# Altium schematic sheet STM32MP1-SOM-Eth.SchDoc: Ethernet PHY with RJ45 connector
size A2; Date: Not used; ApprovedBy: Not used; CheckedBy: Not used; Author: Not used; CompanyName: STMicroelectronics; DrawnBy: Not used; Engineer: Not used; Organization: Not used; Address1: Not used; Address2: Not used; Address3: Not used; Address4: Not used; DocumentNumber: 6; Revision: Not used; SheetNumber: 6; SheetTotal: 9; Time: Not used; ImagePath: Not used; Application_BuildNumber: Not used
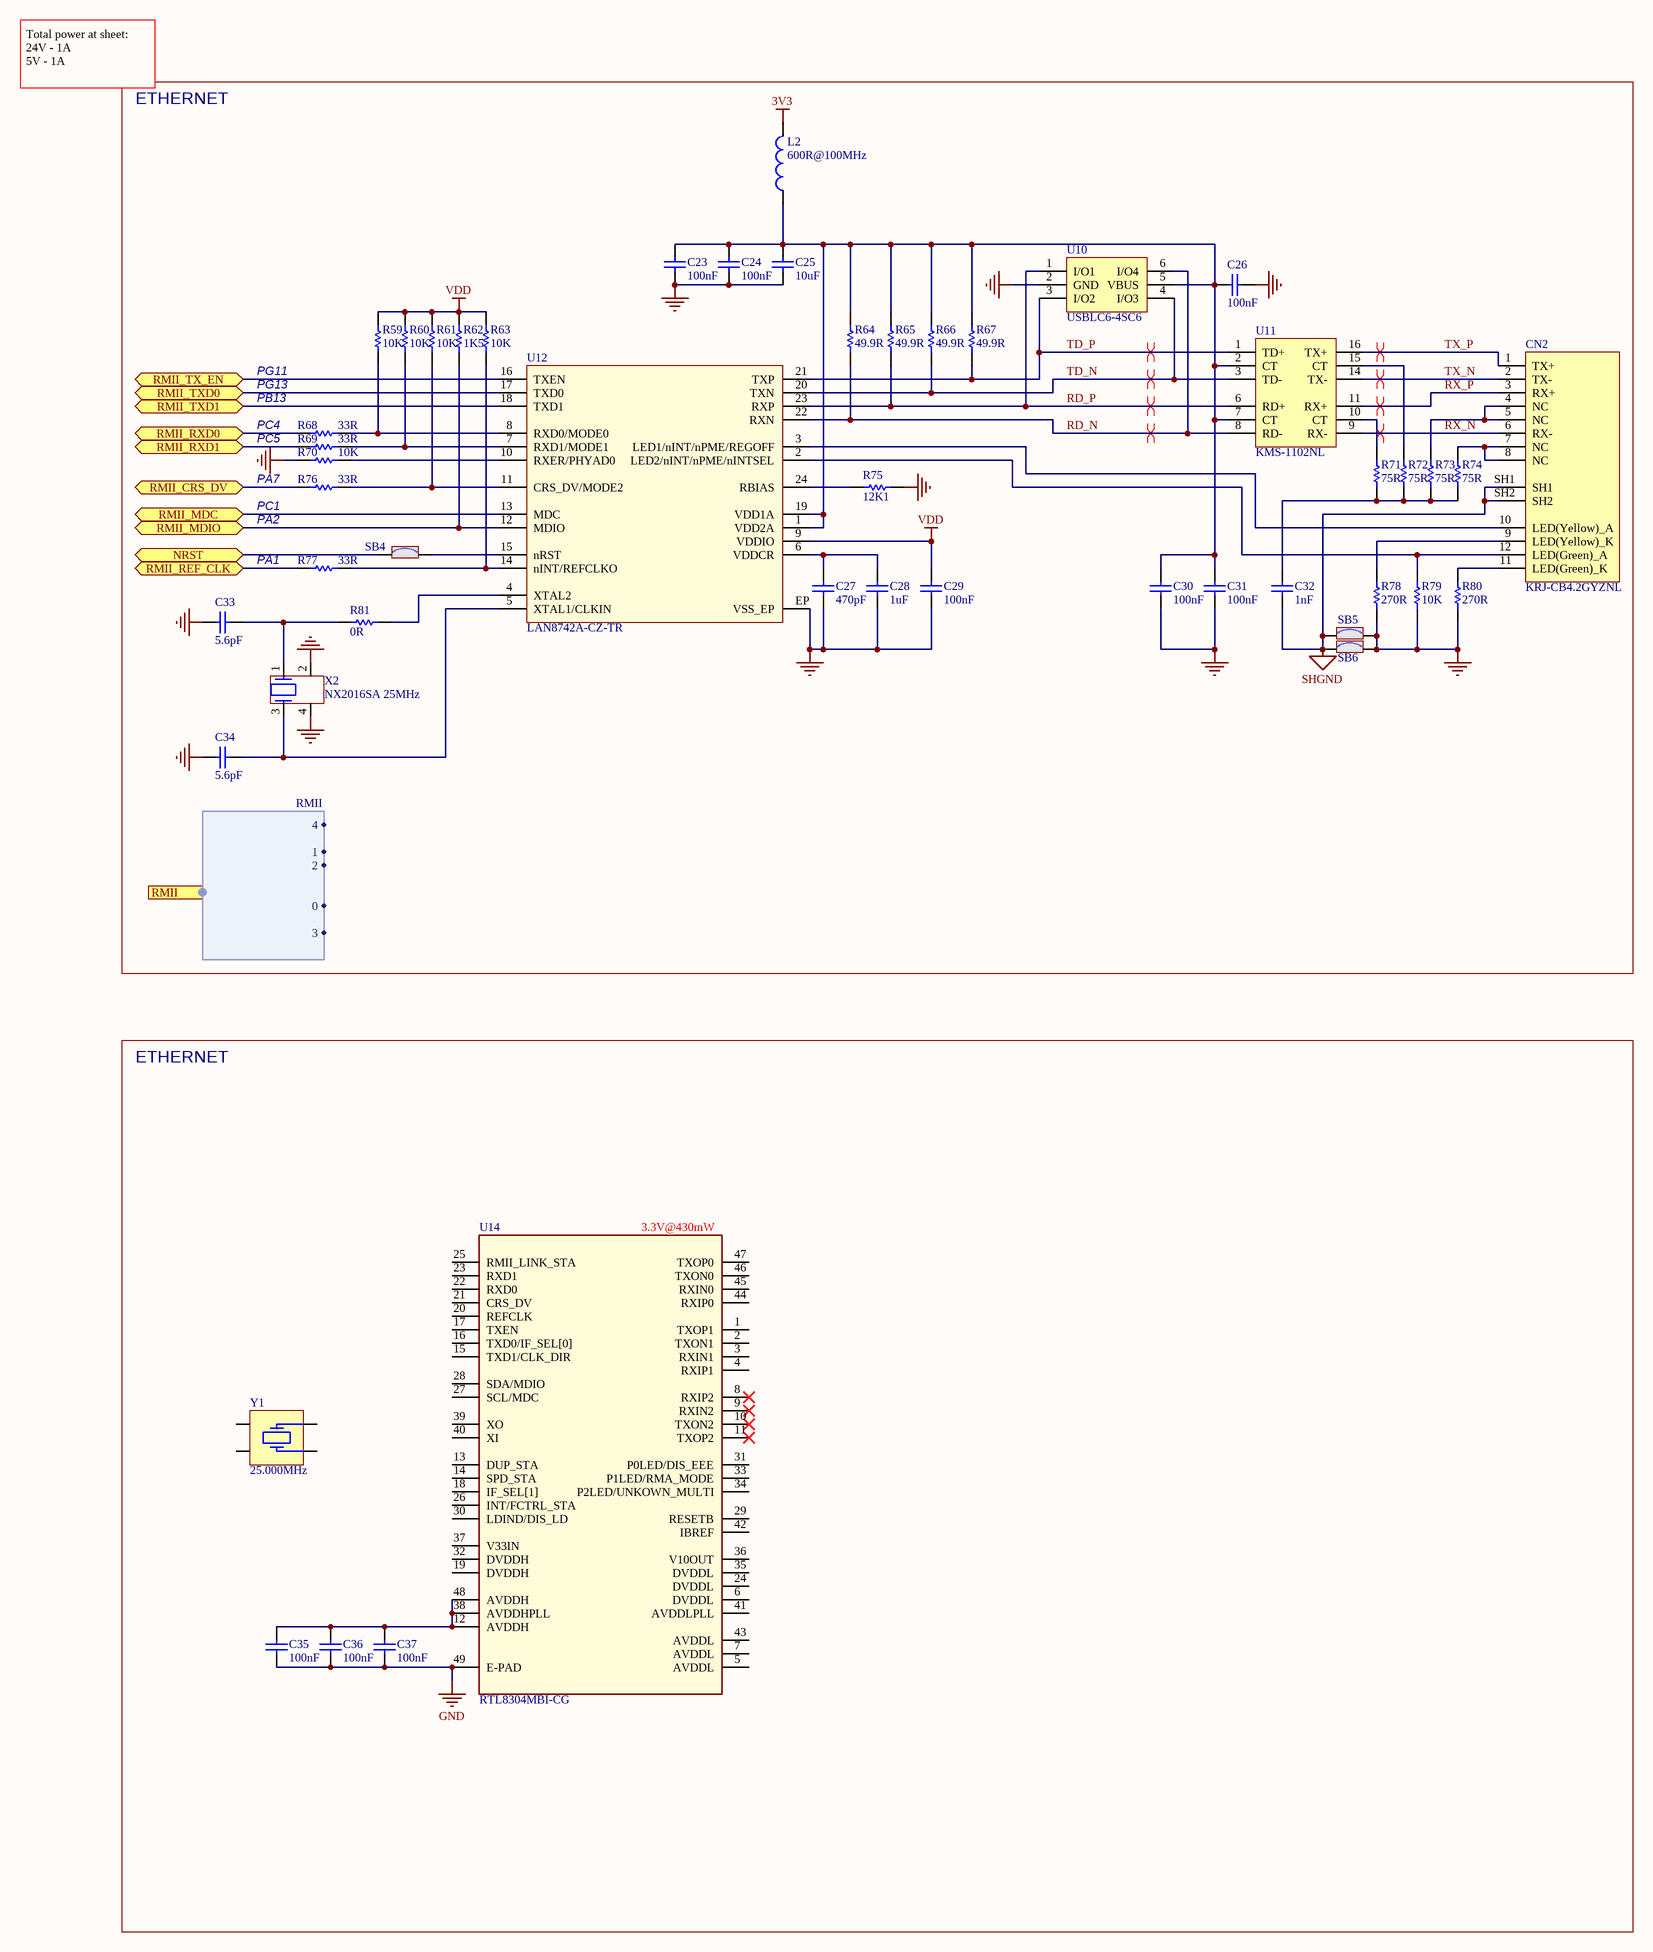
[diagram p0: STM32MP1-SOM-Eth.SchDoc]

## Parts
C23  value 100nF  [C0603]  (hidden comment: Capacitor)
C24  value 100nF  [C0603]  (hidden comment: Capacitor)
C25  value 10uF  [C0603]  (hidden comment: Capacitor)
C26  value 100nF  [C0603]  (hidden comment: Capacitor)
C27  value 470pF  [C0402]  (hidden comment: Capacitor)
C28  value 1uF  [C0402]  (hidden comment: Capacitor)
C29  value 100nF  [C0603]  (hidden comment: Capacitor)
C30  value 100nF  [C0603]  (hidden comment: Capacitor)
C31  value 100nF  [C0603]  (hidden comment: Capacitor)
C32  value 1nF  [C1206_H1P6]  (hidden comment: Capacitor)
C33  value 5.6pF  [C0402]  (hidden comment: Capacitor)
C34  value 5.6pF  [C0402]  (hidden comment: Capacitor)
C35  value 100nF  [C0603]  (hidden comment: Capacitor)
C36  value 100nF  [C0603]  (hidden comment: Capacitor)
C37  value 100nF  [C0603]  (hidden comment: Capacitor)
CN2  value KRJ-CB4.2GYZNL  [CON_RJ45_DGKYD_KRJ-CB4.2GYZNL]  (hidden comment: RJ45_KRJ-CB4.2GYZNL)
L2  value 600R@100MHz  [L0603]  (hidden comment: BEAD)
R59  value 10K  [R0402]  (hidden comment: Resistor)
R60  value 10K  [R0402]  (hidden comment: Resistor)
R61  value 10K  [R0402]  (hidden comment: Resistor)
R62  value 1K5  [R0402]  (hidden comment: Resistor)
R63  value 10K  [R0402]  (hidden comment: Resistor)
R64  value 49.9R  [R0402]  (hidden comment: Resistor)
R65  value 49.9R  [R0402]  (hidden comment: Resistor)
R66  value 49.9R  [R0402]  (hidden comment: Resistor)
R67  value 49.9R  [R0402]  (hidden comment: Resistor)
R68  value 33R  [R0402]  (hidden comment: Resistor)
R69  value 33R  [R0402]  (hidden comment: Resistor)
R70  value 10K  [R0402]  (hidden comment: Resistor)
R71  value 75R  [R0402]  (hidden comment: Resistor)
R72  value 75R  [R0402]  (hidden comment: Resistor)
R73  value 75R  [R0402]  (hidden comment: Resistor)
R74  value 75R  [R0402]  (hidden comment: Resistor)
R75  value 12K1  [R0402]  (hidden comment: Resistor)
R76  value 33R  [R0402]  (hidden comment: Resistor)
R77  value 33R  [R0402]  (hidden comment: Resistor)
R78  value 270R  [R0402]  (hidden comment: Resistor)
R79  value 10K  [R0402]  (hidden comment: Resistor)
R80  value 270R  [R0402]  (hidden comment: Resistor)
R81  value 0R  [R0402]  (hidden comment: Resistor)
SB4  SB_ON  [SOLDER-BRIDGE_R0603-0R]  (value not drawn)
SB5  SB_ON  [SOLDER-BRIDGE_R0603-0R]  (value not drawn)
SB6  SB_ON  [SOLDER-BRIDGE_R0603-0R]  (value not drawn)
U10  USBLC6-4SC6  [ESD_SOT23-6L]
U11  KMS-1102NL  [TRS_DGKYD_KMS-1102NL]
U12  LAN8742A-CZ-TR  [ICC_VQFN24-EPAD_4X4_P050]
U14  RTL8304MBI-CG  [QFN48_SMALL_EP_7MMX7MM]
X2  value NX2016SA 25MHz  [CRY_NX2016SA_4P]  (hidden comment: XTAL_4_PINS)
Y1  25.000MHz  [ABM8G]

## Blocks framed on the sheet
ETHERNET: C23-C34 CN2 L2 R59-R81 SB4-SB6 U10-U12 X2
ETHERNET: C35-C37 U14 Y1

## Ports
NRST (bidir), RMII (harness RMII), RMII_CRS_DV (bidir), RMII_MDC (bidir), RMII_MDIO (bidir), RMII_REF_CLK (bidir), RMII_RXD0 (bidir), RMII_RXD1 (bidir), RMII_TX_EN (bidir), RMII_TXD0 (bidir), RMII_TXD1 (bidir)

## Harnesses
RMII: 0, 1, 2, 3, 4

## Nets
3V3: L2.2
GND: C23.1 C24.1 C25.1 C26.2 C27.1 C28.1 C29.1 C30.1 C31.1 C33.1 C34.1 C35.1 C36.1 C37.1 R70.2 R75.2 R78.1 R79.1 R80.1 SB5.2 SB6.2 U10.2(GND) U12.EP(VSS_EP) U14.49(E-PAD) X2.2 X2.4
SHGND: C32.1 CN2.SH1 CN2.SH2 SB5.1 SB6.1
VDD: C29.2 R59.2 R60.2 R61.2 R62.2 R63.2 U12.9(VDDIO)
NRST: SB4.1 ; port NRST
RD_N: R64.1 U10.6(I/O4) U11.8(RD-) U12.22(RXN)
RD_P: R65.1 U10.1(I/O1) U11.6(RD+) U12.23(RXP)
RMII_CRS_DV: R76.1 ; port RMII_CRS_DV
RMII_MDC: U12.13(MDC) ; port RMII_MDC
RMII_MDIO: R62.1 U12.12(MDIO) ; port RMII_MDIO
RMII_REF_CLK: R77.1 ; port RMII_REF_CLK
RMII_RXD0: R68.1 ; port RMII_RXD0
RMII_RXD1: R69.1 ; port RMII_RXD1
RMII_TX_EN: U12.16(TXEN) ; port RMII_TX_EN
RMII_TXD0: U12.17(TXD0) ; port RMII_TXD0
RMII_TXD1: U12.18(TXD1) ; port RMII_TXD1
RX_N: CN2.6(RX-) U11.9(RX-)
RX_P: CN2.3(RX+) U11.11(RX+)
TD_N: R66.1 U10.4(I/O3) U11.3(TD-) U12.20(TXN)
TD_P: R67.1 U10.3(I/O2) U11.1(TD+) U12.21(TXP)
TX_N: CN2.2(TX-) U11.14(TX-)
TX_P: CN2.1(TX+) U11.16(TX+)
NetC23_2: C23.2 C24.2 C25.2 C26.1 C30.2 C31.2 L2.1 R64.2 R65.2 R66.2 R67.2 U10.5(VBUS) U11.2(CT) U11.7(CT) U12.1(VDD2A) U12.19(VDD1A)
NetC27_2: C27.2 C28.2 U12.6(VDDCR)
NetC32_2: C32.2 R71.1 R72.1 R73.1 R74.1
NetC33_2: C33.2 R81.1 X2.1
NetC34_2: C34.2 U12.5(XTAL1/CLKIN) X2.3
NetC35_2: C35.2 C36.2 C37.2 U14.12(AVDDH) U14.38(AVDDHPLL) U14.48(AVDDH)
NetCN2_4: CN2.4(NC) CN2.5(NC) R73.2
NetCN2_7: CN2.7(NC) CN2.8(NC) R74.2
NetCN2_9: CN2.9(LED(Yellow)_K) R78.2
NetCN2_10: CN2.10(LED(Yellow)_A) U12.3(LED1/nINT/nPME/REGOFF)
NetCN2_11: CN2.11(LED(Green)_K) R80.2
NetCN2_12: CN2.12(LED(Green)_A) R79.2 U12.2(LED2/nINT/nPME/nINTSEL)
NetR59_1: R59.1 R68.2 U12.8(RXD0/MODE0)
NetR60_1: R60.1 R69.2 U12.7(RXD1/MODE1)
NetR61_1: R61.1 R76.2 U12.11(CRS_DV/MODE2)
NetR63_1: R63.1 R77.2 U12.14(nINT/REFCLKO)
NetR70_1: R70.1 U12.10(RXER/PHYAD0)
NetR71_2: R71.2 U11.10(CT)
NetR72_2: R72.2 U11.15(CT)
NetR75_1: R75.1 U12.24(RBIAS)
NetR81_2: R81.2 U12.4(XTAL2)
NetSB4_2: SB4.2 U12.15(nRST)

Not connected (* = marked no-connect by the designer): U14 1(TXOP1) 2(TXON1) 3(RXIN1) 4(RXIP1) 5(AVDDL) 6(DVDDL) 7(AVDDL) 8(RXIP2)* 9(RXIN2)* 10(TXON2)* 11(TXOP2)* 13(DUP_STA) 14(SPD_STA) 15(TXD1/CLK_DIR) 16(TXD0/IF_SEL[0]) 17(TXEN) 18(IF_SEL[1]) 19(DVDDH) 20(REFCLK) 21(CRS_DV) 22(RXD0) 23(RXD1) 24(DVDDL) 25(RMII_LINK_STA) 26(INT/FCTRL_STA) 27(SCL/MDC) 28(SDA/MDIO) 29(RESETB) 30(LDIND/DIS_LD) 31(P0LED/DIS_EEE) 32(DVDDH) 33(P1LED/RMA_MODE) 34(P2LED/UNKOWN_MULTI) 35(DVDDL) 36(V10OUT) 37(V33IN) 39(XO) 40(XI) 41(AVDDLPLL) 42(IBREF) 43(AVDDL) 44(RXIP0) 45(RXIN0) 46(TXON0) 47(TXOP0); Y1 1 2 3 4

## Layout directives
differential pair: RD_N, RD_P, RX_N, RX_P, TD_N, TD_P, TX_N, TX_P

## Notes on the sheet
- Total power at sheet:
  24V - 1A
  5V - 1A
- PG11
- PG13
- PB13
- PC4
- PC5
- PA7
- PC1
- PA2
- (near R77) PA1
- (near U14) 3.3V@430mW
- Title
- Size:
- Date:
- File:
- A2
- Number:
- Time:
- Revision:
- Sheet
- of

## Library data of the parts
C23 C24 C26 C29-C31 = MCD-00237: Capacitor, MLCC, 100nF, 6V3, X5R, 10%, 0603, T=0,8mm; Manufacturer_Part_Number: CC0603KRX5R5BB104; Manufacturer: YAGEO; Provided_By: SUBCO; ECCN_US: EAR99; ECCN_EU: NEC; Internal_Part_Number: MCD-00237; Status: Released; Part_Type: Capacitor; Package: C0603; ComponentLink1Description: Datasheet; ComponentLink1URL: http://tunmcdsvn.tun.st.com/Component_Datasheet_Library/Trunk/Capacitors/Yageo_Multilayer_capacitor_X5R_series_100pF_to_100uF
C25 = MCD-01124: Capacitor, MLCC, 10µF, 10V, X5R, 10%, 0603, T=0.8mm; Manufacturer_Part_Number: GRM188R61A106KAAL; Manufacturer: MURATA; Provided_By: SUBCO; ECCN_US: EAR99; ECCN_EU: NEC; Internal_Part_Number: MCD-01124; Status: Released; Part_Type: Capacitor; Package: C0603; ComponentLink1Description: Datasheet; ComponentLink1URL: http://tunmcdsvn.tun.st.com/Component_Datasheet_Library/Trunk/Capacitors/Murata_Capacitor_GR_series
C27 = MCD-00724: Capacitor, MLCC, 470pF, 50V, NPO, 5%, 0402, T=0,5mm; Manufacturer_Part_Number: CC0402JRNPO9BN471; Manufacturer: YAGEO; Provided_By: SUBCO; Internal_Part_Number: MCD-00724; Status: Released; Part_Type: Capacitor; Package: C0402; ComponentLink1Description: Datasheet; ComponentLink1URL: http://tunmcdsvn.tun.st.com/Component_Datasheet_Library/Trunk/Capacitors/Yageo_Capacitor_NP0_16V-to-50V; ECCN_US: N/A; ECCN_EU: N/A
C28 = MCD-00095: Capacitor, MLCC, 1uF, 6V3, X5R, 10%, 0402, T=0,5mm; Manufacturer_Part_Number: GRM155R61E105KA12; Manufacturer: MURATA; Alternate_Manufacturer_Part_Number: GRM155R60J105KE19; Provided_By: SUBCO; ECCN_US: EAR99; ECCN_EU: NEC; Internal_Part_Number: MCD-00095; Status: Released; Part_Type: Capacitor; Package: C0402; ComponentLink1Description: Datasheet; ComponentLink1URL: http://tunmcdsvn.tun.st.com/Component_Datasheet_Library/Trunk/Capacitors/Murata_Capacitor_GR_series; Alternate_Manufacturer: MURATA
C32 = MCD-00722: Capacitor, MLCC, 1nF, 2KV, X7R, 10%, 1206, T=1,25mm; Manufacturer_Part_Number: CC1206KKX7RDBB102; Manufacturer: YAGEO; Provided_By: SUBCO; Internal_Part_Number: MCD-00722; Status: Released; Part_Type: Capacitor; Package: C1206; ComponentLink1Description: Datasheet; ComponentLink1URL: http://tunmcdsvn.tun.st.com/Component_Datasheet_Library/Trunk/Capacitors/Yageo_Multilayer_Capacitor_NPO_X7R_1KV_to_3KV_10pF_to_33nF/; ECCN_US: N/A; ECCN_EU: N/A
C33 C34 = MCD-01374: Capacitor, MLCC, 5.6pF, 50V, NPO, 5%, 0402, T=0,5mm; Manufacturer_Part_Number: CC0402BRNPO9BN5R6; Manufacturer: YAGEO; Provided_By: SUBCO; Internal_Part_Number: MCD-01374; Status: Released; Part_Type: Capacitor; Package: C0402; ComponentLink1Description: Datasheet; ComponentLink1URL: http://tunmcdsvn.tun.st.com/Component_Datasheet_Library/Trunk/Capacitors/Yageo_Capacitor_NP0_16V-to-50V; ECCN_US: N/A; ECCN_EU: N/A
C35-C37 = Capacitor_1: Capacitor, MLCC, 100nF, 6V3, X5R, 10%, 0603, T=0,8mm; Internal_Part_Number: MCD-00237; Manufacturer_Part_Number: CC0603KRX5R5BB104; Manufacturer: YAGEO; Provided_By: SUBCO; ECCN_US: EAR99; ECCN_EU: NEC; Status: Released; Part_Type: Capacitor; Package: C0603; ComponentLink1Description: Datasheet; ComponentLink1URL: http://tunmcdsvn.tun.st.com/Component_Datasheet_Library/Trunk/Capacitors/Yageo_Multilayer_capacitor_X5R_series_100pF_to_100uF
CN2 = MCD-00717: RJ45 jack, single port, with LEDS, Metal shielded dip low profile; Part_Type: Connector; Manufacturer: DONGGUAN KEYOUDA ELECTRONIC TECHNOLOGY; Provided_By: SUBCO; Internal_Part_Number: MCD-00717; Status: Released; Manufacturer_Part_Number: KRJ-CB4.2GYZNL; ComponentLink1Description: Datasheet; ComponentLink1URL: http://tunmcdsvn.tun.st.com/Component_Datasheet_Library/Trunk/Connectors/DGKYD_RJ45_KRJ-CB4.2GYZNL; ECCN_US: n/a; ECCN_EU: n/a
L2 = MCD-00047: SMD Chip ferrite bead, 600R@100MHz +/-25%, 350mA, 500mohm DC, 0603, T=0.8mm; Part_Type: Inductor; Manufacturer_Part_Number: FCM1608KF-601T03; Manufacturer: TAI-TECH; Provided_By: SUBCO; Internal_Part_Number: MCD-00047; Status: Released; ComponentLink1Description: Datasheet; ComponentLink1URL: http://tunmcdsvn.tun.st.com/Component_Datasheet_Library/Trunk/Inductors/TaiTech_Bead_FCM1608_series; ECCN_US: n/a; ECCN_EU: n/a
R59-R61 R63 R70 R79 = MCD-00053: Resistor,10K,0402,1%,1/16W; Manufacturer_Part_Number: RC0402FR-0710KL; Manufacturer: YAGEO; Provided_By: SUBCO; ECCN_US: EAR99; ECCN_EU: NEC; Internal_Part_Number: MCD-00053; Status: Released; Part_Type: Resistor; Package: R0402; ComponentLink1Description: Datasheet; ComponentLink1URL: http://tunmcdsvn.tun.st.com/Component_Datasheet_Library/Trunk/Resistors/Yageo_Resistor_RC0402-series
R62 = MCD-00068: Resistor,1K5,0402,1%,1/16W; Manufacturer_Part_Number: RC0402FR-071K5L; Manufacturer: YAGEO; Provided_By: SUBCO; ECCN_US: EAR99; ECCN_EU: NEC; Internal_Part_Number: MCD-00068; Status: Released; Part_Type: Resistor; Package: R0402; ComponentLink1Description: Datasheet; ComponentLink1URL: http://tunmcdsvn.tun.st.com/Component_Datasheet_Library/Trunk/Resistors/Yageo_Resistor_RC0402-series
R64-R67 = MCD-00565: Resistor,49R9,0402,1%,1/16W; Manufacturer_Part_Number: RC0402FR-0749R9L; Manufacturer: YAGEO; Provided_By: SUBCO; ECCN_US: EAR99; ECCN_EU: NEC; Internal_Part_Number: MCD-00565; Status: Released; Part_Type: Resistor; Package: R0402; ComponentLink1Description: Datasheet; ComponentLink1URL: http://tunmcdsvn.tun.st.com/Component_Datasheet_Library/Trunk/Resistors/Yageo_Resistor_RC0402-series
R68 R69 R76 R77 = MCD-00455: Resistor,33R,0402,1%,1/16W; Manufacturer_Part_Number: RC0402FR-0733RL; Manufacturer: YAGEO; Provided_By: SUBCO; ECCN_US: EAR99; ECCN_EU: NEC; Internal_Part_Number: MCD-00455; Status: Released; Part_Type: Resistor; Package: R0402; ComponentLink1Description: Datasheet; ComponentLink1URL: http://tunmcdsvn.tun.st.com/Component_Datasheet_Library/Trunk/Resistors/Yageo_Resistor_RC0402-series
R71-R74 = MCD-00515: Resistor,75R,0402,1%,1/16W; Manufacturer_Part_Number: RC0402FR-0775RL; Manufacturer: YAGEO; Provided_By: SUBCO; ECCN_US: EAR99; ECCN_EU: NEC; Internal_Part_Number: MCD-00515; Status: Released; Part_Type: Resistor; Package: R0402; ComponentLink1Description: Datasheet; ComponentLink1URL: http://tunmcdsvn.tun.st.com/Component_Datasheet_Library/Trunk/Resistors/Yageo_Resistor_RC0402-series
R75 = MCD-00723: Resistor,12K1,0402,1%,1/16W; Manufacturer_Part_Number: RC0402FR-0712K1L; Manufacturer: YAGEO; Provided_By: SUBCO; ECCN_US: EAR99; ECCN_EU: NEC; Internal_Part_Number: MCD-00723; Status: Released; Part_Type: Resistor; Package: R0402; ComponentLink1Description: Datasheet; ComponentLink1URL: http://tunmcdsvn.tun.st.com/Component_Datasheet_Library/Trunk/Resistors/Yageo_Resistor_RC0402-series
R78 R80 = MCD-00441: Resistor,270R,0402,1%,1/16W; Manufacturer_Part_Number: RC0402FR-07270RL; Manufacturer: YAGEO; Provided_By: SUBCO; ECCN_US: EAR99; ECCN_EU: NEC; Internal_Part_Number: MCD-00441; Status: Released; Part_Type: Resistor; Package: R0402; ComponentLink1Description: Datasheet; ComponentLink1URL: http://tunmcdsvn.tun.st.com/Component_Datasheet_Library/Trunk/Resistors/Yageo_Resistor_RC0402-series
R81 = MCD-00052: Resistor,0R,0402,5%,1/16W; Manufacturer_Part_Number: RC0402JR-070RL; Manufacturer: YAGEO; Provided_By: SUBCO; ECCN_US: EAR99; ECCN_EU: NEC; Internal_Part_Number: MCD-00052; Status: Released; Part_Type: Resistor; Package: R0402; ComponentLink1Description: Datasheet; ComponentLink1URL: http://tunmcdsvn.tun.st.com/Component_Datasheet_Library/Trunk/Resistors/Yageo_Resistor_RC0402-series
SB4-SB6 = MCD-00071: Solder Bridge ON; Part_Type: Mechanical; Manufacturer_Part_Number: RC0603JR-070RL; Manufacturer: YAGEO; Provided_By: SUBCO; Internal_Part_Number: MCD-00071; Status: Released; ComponentLink1Description: Datasheet; Package: SB0603; ComponentLink1URL: http://tunmcdsvn.tun.st.com/Component_Datasheet_Library/Trunk/Resistors/Yageo_Resistor_RC0603-series; ECCN_US: n/a; ECCN_EU: n/a
U10 = MCD-00250: Very low capacitance ESD protection , 4 lines; Part_Type: IC; Manufacturer: STMICROELECTRONICS; BMS_Part_Number: 9151001; Provided_By: SUBCO with ST control; ECCN_US: EAR99; ECCN_EU: NEC; Internal_Part_Number: MCD-00250; Value: USBLC6-4SC6; Status: Released; Manufacturer_Part_Number: USBLC6-4SC6; ComponentLink1Description: Datasheet; ComponentLink1URL: http://tunmcdsvn.tun.st.com/Component_Datasheet_Library/Trunk/Diodes/STM_ESD_USBLC6-4SC6
U11 = MCD-00718: Discrete Magnetic Transformer Module, 16 pins, SMT, 100 Base-TX; Part_Type: IC; Manufacturer: DONGGUAN KEYOUDA ELECTRONIC TECHNOLOGY; Provided_By: SUBCO; Internal_Part_Number: MCD-00718; Value: KMS-1102NL; Status: Released; Manufacturer_Part_Number: KMS-1102NL; ComponentLink1Description: Datasheet; ComponentLink1URL: http://tunmcdsvn.tun.st.com/Component_Datasheet_Library/Trunk/IC/DGKYD_KMS-1102NL; ECCN_US: n/a; ECCN_EU: n/a
U12 = MCD-00719: 10/100M RMII Ethernet transceiver; Part_Type: IC; Manufacturer: MICROCHIP; Provided_By: SUBCO; Internal_Part_Number: MCD-00719; Value: LAN8742A-CZ-TR; Status: Released; Manufacturer_Part_Number: LAN8742A-CZ-TR; ComponentLink1Description: Datasheet; ComponentLink1URL: http://tunmcdsvn.tun.st.com/Component_Datasheet_Library/Trunk/IC/MICROCHIP_LAN8742A_RMII_PHY; ECCN_US: n/a; ECCN_EU: n/a
U14 = RTL8304MBI-CG: SINGLE-CHIP 4-PORT 10/100M ETHERNET SWITCH CONTROLLER; Manufacturer: REALTEK; Number of Drivers/Receivers: 4/4; Duplex: Full; Voltage - Supply: 1.8V, 2.5V, 3.3V; .Creator: MM; Supplier 1: Digi-Key; RoHS: RoHS Compliant; Category: Integrated Circuits (ICs); Stock 1: 1755; Packaging: Tray; Type: Transceiver; Protocol: Ethernet; Receiver Hysteresis: -; Data Rate: -; Operating Temperature: -40°C ~ 85°C; Mounting Type: Surface Mount; Package / Case: 48-VFQFN Exposed Pad; Supplier Device Package: 48-QFN (7x7); ComponentLink1Description: datasheet; .Checked PCB: MM; .Checked SCH: MM; Value: RTL8304MBI-CG
X2 = MCD-01364: Crystal 25MHz, 6pF, +-20ppm, 80ohms max, SMD; Part_Type: Crystal_Osc; Manufacturer_Part_Number: NX2016SA 25MHz EXS00A-CS11321; Manufacturer: NDK; BMS_Part_Number: 9157044; Provided_By: SUBCO; ECCN_US: EAR99; ECCN_EU: NEC; Internal_Part_Number: MCD-01364; Status: Released; Package: NX2016SA; ComponentLink1Description: Datasheet; ComponentLink1URL: http://tunmcdsvn.tun.st.com/Component_Datasheet_Library/Trunk/Crystal_Osc/NDK_NX2016SA 25MHz EXS00A-CS11321 (EXS10B-28187); Order_Code_Digikey: 644-1367
Y1 = ABM8G-25.000MHZ-18-D2Y-T: CRYSTAL 25MHZ 18PF SMD; Manufacturer: Abracon Corporation; Frequency Stability: ±30ppm; Frequency Tolerance: ±20ppm; ESR (Equivalent Series Resistance): 60 Ohm; Operating Mode: Fundamental; .Checked PCB: MM; Supplier 1: Digi-Key; Manufacturer Part Number: ABM8G-25.000MHZ-18-D2Y-T; RoHS: RoHS Compliant; Category: Crystals and Oscillators; Stock 1: 25549; Pricing 1: 1=1.06, 10=0.944, 50=0.8814, 100=0.78, 500=0.7371 (USD); Packaging: Cut Tape (CT); Type: MHz Crystal; Frequency: 25MHz; Load Capacitance: 18pF; Operating Temperature: -40°C ~ 85°C; Ratings: -; Mounting Type: Surface Mount; Package / Case: 4-SMD, No Lead (DFN, LCC); Size / Dimension: 0.126" L x 0.098" W (3.20mm x 2.50mm); Height: 0.039" (1.00mm); ComponentLink1URL: http://www.abracon.com/Resonators/ABM8G.pdf; ComponentLink1Description: http://www.abracon.com/Resonators/ABM8G.pdf; Supplier Part Number 1: 535-10275-1-ND; .Checked SCH: MM; .Creator: MM